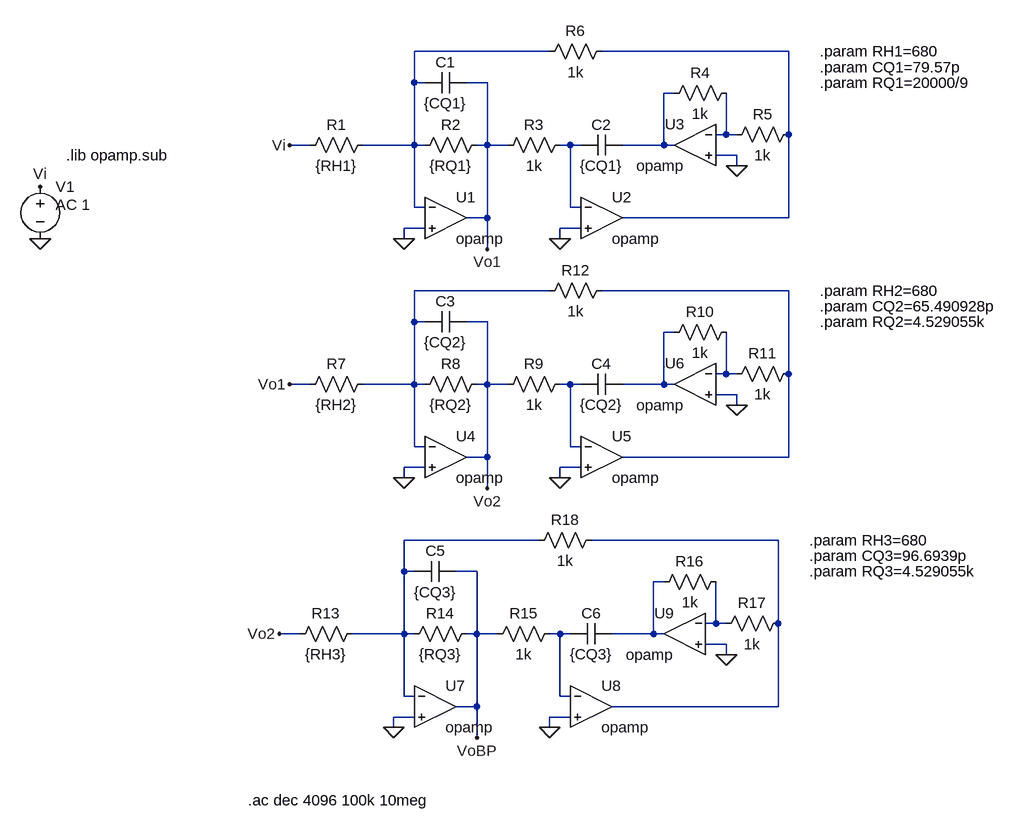
[diagram p0: schematic Draft2.asc]
Draft2.asc, the LTspice schematic file:
Version 4
SHEET 1 1228 1136
WIRE 320 -32 112 -32
WIRE 688 -32 400 -32
WIRE 112 16 112 -32
WIRE 128 16 112 16
WIRE 224 16 192 16
WIRE 512 32 496 32
WIRE 592 96 592 32
WIRE 592 96 576 96
WIRE 608 96 592 96
WIRE 688 96 688 -32
WIRE -48 112 -80 112
WIRE 112 112 112 16
WIRE 112 112 32 112
WIRE 128 112 112 112
WIRE 224 112 224 16
WIRE 224 112 208 112
WIRE 256 112 224 112
WIRE 352 112 336 112
WIRE 368 112 352 112
WIRE 496 112 496 32
WIRE 496 112 432 112
WIRE 512 112 496 112
WIRE 608 128 576 128
WIRE 608 144 608 128
WIRE 112 208 112 112
WIRE 128 208 112 208
WIRE 352 208 352 112
WIRE 368 208 352 208
WIRE 224 224 224 112
WIRE 224 224 192 224
WIRE 688 224 688 96
WIRE 688 224 432 224
WIRE 128 240 96 240
WIRE 368 240 336 240
WIRE 96 256 96 240
WIRE 336 256 336 240
WIRE 224 272 224 224
WIRE 320 336 112 336
WIRE 688 336 400 336
WIRE 112 384 112 336
WIRE 128 384 112 384
WIRE 224 384 192 384
WIRE 512 400 496 400
WIRE 592 464 592 400
WIRE 592 464 576 464
WIRE 608 464 592 464
WIRE 688 464 688 336
WIRE -48 480 -80 480
WIRE 112 480 112 384
WIRE 112 480 32 480
WIRE 128 480 112 480
WIRE 224 480 224 384
WIRE 224 480 208 480
WIRE 256 480 224 480
WIRE 352 480 336 480
WIRE 368 480 352 480
WIRE 496 480 496 400
WIRE 496 480 432 480
WIRE 512 480 496 480
WIRE 608 496 576 496
WIRE 608 512 608 496
WIRE 112 576 112 480
WIRE 128 576 112 576
WIRE 352 576 352 480
WIRE 368 576 352 576
WIRE 224 592 224 480
WIRE 224 592 192 592
WIRE 688 592 688 464
WIRE 688 592 432 592
WIRE 128 608 96 608
WIRE 368 608 336 608
WIRE 96 624 96 608
WIRE 336 624 336 608
WIRE 224 640 224 592
WIRE 304 720 96 720
WIRE 672 720 384 720
WIRE 96 768 96 720
WIRE 112 768 96 768
WIRE 208 768 176 768
WIRE 496 784 480 784
WIRE 576 848 576 784
WIRE 576 848 560 848
WIRE 592 848 576 848
WIRE 672 848 672 720
WIRE -64 864 -96 864
WIRE 96 864 96 768
WIRE 96 864 16 864
WIRE 112 864 96 864
WIRE 208 864 208 768
WIRE 208 864 192 864
WIRE 240 864 208 864
WIRE 336 864 320 864
WIRE 352 864 336 864
WIRE 480 864 480 784
WIRE 480 864 416 864
WIRE 496 864 480 864
WIRE 592 880 560 880
WIRE 592 896 592 880
WIRE 96 960 96 864
WIRE 112 960 96 960
WIRE 336 960 336 864
WIRE 352 960 336 960
WIRE 208 976 208 864
WIRE 208 976 176 976
WIRE 672 976 672 848
WIRE 672 976 416 976
WIRE 112 992 80 992
WIRE 352 992 320 992
WIRE 80 1008 80 992
WIRE 320 1008 320 992
WIRE 208 1024 208 976
FLAG 96 256 0
FLAG 336 256 0
FLAG 608 144 0
FLAG -80 112 Vi
FLAG 224 272 Vo1
FLAG -464 256 0
FLAG -464 176 Vi
FLAG 96 624 0
FLAG 336 624 0
FLAG 608 512 0
FLAG 80 1008 0
FLAG 320 1008 0
FLAG 592 896 0
FLAG 208 1024 VoBP
FLAG -80 480 Vo1
FLAG 224 640 Vo2
FLAG -96 864 Vo2
SYMBOL res 48 96 R90
WINDOW 0 0 56 VBottom 2
WINDOW 3 32 56 VTop 2
SYMATTR InstName R1
SYMATTR Value {RH1}
SYMBOL res 224 96 R90
WINDOW 0 0 56 VBottom 2
WINDOW 3 32 56 VTop 2
SYMATTR InstName R2
SYMATTR Value {RQ1}
SYMBOL cap 192 0 R90
WINDOW 0 0 32 VBottom 2
WINDOW 3 32 32 VTop 2
SYMATTR InstName C1
SYMATTR Value {CQ1}
SYMBOL res 352 96 R90
WINDOW 0 0 56 VBottom 2
WINDOW 3 32 56 VTop 2
SYMATTR InstName R3
SYMATTR Value 1k
SYMBOL cap 432 96 R90
WINDOW 0 0 32 VBottom 2
WINDOW 3 32 32 VTop 2
SYMATTR InstName C2
SYMATTR Value {CQ1}
SYMBOL OpAmps\\opamp 160 160 R0
SYMATTR InstName U1
SYMATTR SpiceLine Aol=100000Meg
SYMATTR SpiceLine2 GBW=100000Meg
SYMBOL res 608 16 R90
WINDOW 0 0 56 VBottom 2
WINDOW 3 32 56 VTop 2
SYMATTR InstName R4
SYMATTR Value 1k
SYMBOL res 704 80 R90
WINDOW 0 0 56 VBottom 2
WINDOW 3 32 56 VTop 2
SYMATTR InstName R5
SYMATTR Value 1k
SYMBOL res 416 -48 R90
WINDOW 0 0 56 VBottom 2
WINDOW 3 32 56 VTop 2
SYMATTR InstName R6
SYMATTR Value 1k
SYMBOL voltage -464 160 R0
WINDOW 123 24 44 Left 2
WINDOW 39 0 0 Left 0
SYMATTR Value2 AC 1
SYMATTR InstName V1
SYMATTR Value ""
SYMBOL res 48 464 R90
WINDOW 0 0 56 VBottom 2
WINDOW 3 32 56 VTop 2
SYMATTR InstName R7
SYMATTR Value {RH2}
SYMBOL res 224 464 R90
WINDOW 0 0 56 VBottom 2
WINDOW 3 32 56 VTop 2
SYMATTR InstName R8
SYMATTR Value {RQ2}
SYMBOL cap 192 368 R90
WINDOW 0 0 32 VBottom 2
WINDOW 3 32 32 VTop 2
SYMATTR InstName C3
SYMATTR Value {CQ2}
SYMBOL res 352 464 R90
WINDOW 0 0 56 VBottom 2
WINDOW 3 32 56 VTop 2
SYMATTR InstName R9
SYMATTR Value 1k
SYMBOL cap 432 464 R90
WINDOW 0 0 32 VBottom 2
WINDOW 3 32 32 VTop 2
SYMATTR InstName C4
SYMATTR Value {CQ2}
SYMBOL res 608 384 R90
WINDOW 0 0 56 VBottom 2
WINDOW 3 32 56 VTop 2
SYMATTR InstName R10
SYMATTR Value 1k
SYMBOL res 704 448 R90
WINDOW 0 0 56 VBottom 2
WINDOW 3 32 56 VTop 2
SYMATTR InstName R11
SYMATTR Value 1k
SYMBOL res 416 320 R90
WINDOW 0 0 56 VBottom 2
WINDOW 3 32 56 VTop 2
SYMATTR InstName R12
SYMATTR Value 1k
SYMBOL res 32 848 R90
WINDOW 0 0 56 VBottom 2
WINDOW 3 32 56 VTop 2
SYMATTR InstName R13
SYMATTR Value {RH3}
SYMBOL res 208 848 R90
WINDOW 0 0 56 VBottom 2
WINDOW 3 32 56 VTop 2
SYMATTR InstName R14
SYMATTR Value {RQ3}
SYMBOL cap 176 752 R90
WINDOW 0 0 32 VBottom 2
WINDOW 3 32 32 VTop 2
SYMATTR InstName C5
SYMATTR Value {CQ3}
SYMBOL res 336 848 R90
WINDOW 0 0 56 VBottom 2
WINDOW 3 32 56 VTop 2
SYMATTR InstName R15
SYMATTR Value 1k
SYMBOL cap 416 848 R90
WINDOW 0 0 32 VBottom 2
WINDOW 3 32 32 VTop 2
SYMATTR InstName C6
SYMATTR Value {CQ3}
SYMBOL res 592 768 R90
WINDOW 0 0 56 VBottom 2
WINDOW 3 32 56 VTop 2
SYMATTR InstName R16
SYMATTR Value 1k
SYMBOL res 688 832 R90
WINDOW 0 0 56 VBottom 2
WINDOW 3 32 56 VTop 2
SYMATTR InstName R17
SYMATTR Value 1k
SYMBOL res 400 704 R90
WINDOW 0 0 56 VBottom 2
WINDOW 3 32 56 VTop 2
SYMATTR InstName R18
SYMATTR Value 1k
SYMBOL OpAmps\\opamp 400 160 R0
SYMATTR InstName U2
SYMATTR SpiceLine Aol=100000Meg
SYMATTR SpiceLine2 GBW=100000Meg
SYMBOL OpAmps\\opamp 544 48 M0
SYMATTR InstName U3
SYMATTR SpiceLine Aol=100000Meg
SYMATTR SpiceLine2 GBW=100000Meg
SYMBOL OpAmps\\opamp 160 528 R0
SYMATTR InstName U4
SYMATTR SpiceLine Aol=100000Meg
SYMATTR SpiceLine2 GBW=100000Meg
SYMBOL OpAmps\\opamp 400 528 R0
SYMATTR InstName U5
SYMATTR SpiceLine Aol=100000Meg
SYMATTR SpiceLine2 GBW=100000Meg
SYMBOL OpAmps\\opamp 544 416 M0
SYMATTR InstName U6
SYMATTR SpiceLine Aol=100000Meg
SYMATTR SpiceLine2 GBW=100000Meg
SYMBOL OpAmps\\opamp 144 912 R0
SYMATTR InstName U7
SYMATTR SpiceLine Aol=100000Meg
SYMATTR SpiceLine2 GBW=100000Meg
SYMBOL OpAmps\\opamp 384 912 R0
SYMATTR InstName U8
SYMATTR SpiceLine Aol=100000Meg
SYMATTR SpiceLine2 GBW=100000Meg
SYMBOL OpAmps\\opamp 528 800 M0
SYMATTR InstName U9
SYMATTR SpiceLine Aol=100000Meg
SYMATTR SpiceLine2 GBW=100000Meg
TEXT -424 128 Left 2 !.lib opamp.sub
TEXT 736 -32 Left 2 !.param RH1=680
TEXT 736 -8 Left 2 !.param CQ1=79.57p
TEXT -144 1120 Left 2 !.ac dec 4096 100k 10meg
TEXT 736 16 Left 2 !.param RQ1=20000/9
TEXT 736 336 Left 2 !.param RH2=680
TEXT 736 360 Left 2 !.param CQ2=65.490928p
TEXT 736 384 Left 2 !.param RQ2=4.529055k
TEXT 720 720 Left 2 !.param RH3=680
TEXT 720 744 Left 2 !.param CQ3=96.6939p
TEXT 720 768 Left 2 !.param RQ3=4.529055k

The netlist it stands for:
* Draft2.asc
R1 N001 Vi {RH1}
R2 Vo1 N001 {RQ1}
C1 Vo1 N001 {CQ1}
R3 N005 Vo1 1k
C2 N003 N005 {CQ1}
XU1 N001 0 Vo1 opamp Aol=100000Meg GBW=100000Meg  ; pins invin noninvin out
R4 N004 N003 1k
R5 N002 N004 1k
R6 N002 N001 1k
V1 Vi 0 AC 1
R7 N006 Vo1 {RH2}
R8 Vo2 N006 {RQ2}
C3 Vo2 N006 {CQ2}
R9 N010 Vo2 1k
C4 N008 N010 {CQ2}
R10 N009 N008 1k
R11 N007 N009 1k
R12 N007 N006 1k
R13 N011 Vo2 {RH3}
R14 VoBP N011 {RQ3}
C5 VoBP N011 {CQ3}
R15 N015 VoBP 1k
C6 N013 N015 {CQ3}
R16 N014 N013 1k
R17 N012 N014 1k
R18 N012 N011 1k
XU2 N005 0 N002 opamp Aol=100000Meg GBW=100000Meg  ; pins invin noninvin out
XU3 N004 0 N003 opamp Aol=100000Meg GBW=100000Meg  ; pins invin noninvin out
XU4 N006 0 Vo2 opamp Aol=100000Meg GBW=100000Meg  ; pins invin noninvin out
XU5 N010 0 N007 opamp Aol=100000Meg GBW=100000Meg  ; pins invin noninvin out
XU6 N009 0 N008 opamp Aol=100000Meg GBW=100000Meg  ; pins invin noninvin out
XU7 N011 0 VoBP opamp Aol=100000Meg GBW=100000Meg  ; pins invin noninvin out
XU8 N015 0 N012 opamp Aol=100000Meg GBW=100000Meg  ; pins invin noninvin out
XU9 N014 0 N013 opamp Aol=100000Meg GBW=100000Meg  ; pins invin noninvin out
.lib opamp.sub
.param RH1=680
.param CQ1=79.57p
.ac dec 4096 100k 10meg
.param RQ1=20000/9
.param RH2=680
.param CQ2=65.490928p
.param RQ2=4.529055k
.param RH3=680
.param CQ3=96.6939p
.param RQ3=4.529055k
.backanno
.end